# EAGLE design TwoDigitThermometer (EAGLE 7.6.0)

## Sheet 1 of 2
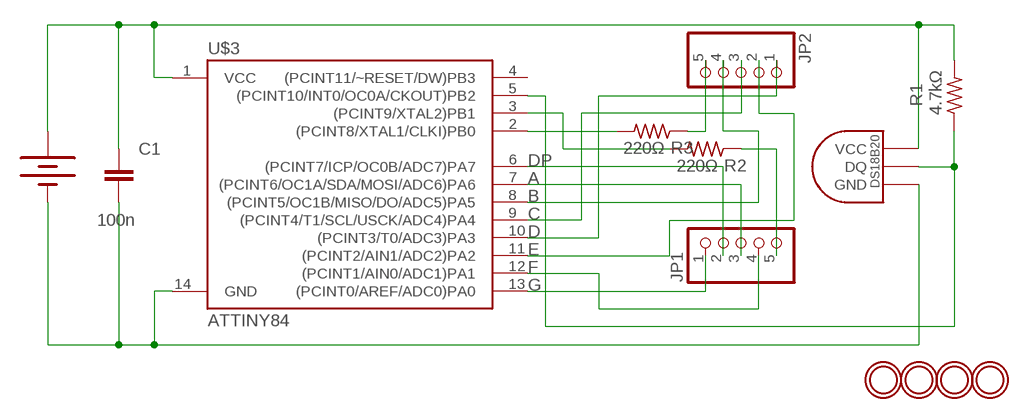
[diagram p0: schematic, sheet 1]

### Parts
BAT1  20mm coincell  BATTERY20SMD  [BATTCON_20MM]
C1  100n  CAP0603-CAP  [0603-CAP]
JP1  HEADER-1X5EDGESMT  [1X05_EDGESMT]
JP2  HEADER-1X5EDGESMT  [1X05_EDGESMT]
R1  4.7kΩ  R-US_R0805  [R0805]
R2  220Ω  R-US_R0805  [R0805]
R3  220Ω  R-US_R0805  [R0805]
U$1  MOUNTINGHOLE2.5  [MOUNTINGHOLE_2.5_PLATED]
U$2  DS1820  [µSOP8]
U$3  ATTINY84  [SO14]
U$4  MOUNTINGHOLE2.5  [MOUNTINGHOLE_2.5_PLATED]
U$5  MOUNTINGHOLE2.5  [MOUNTINGHOLE_2.5_PLATED]
U$9  MOUNTINGHOLE2.5  [MOUNTINGHOLE_2.5_PLATED]

### Nets
A: JP1.3 U$3.7((PCINT6/OC1A/SDA/MOSI/ADC6)PA6)
B: JP2.4 U$3.8((PCINT5/OC1B/MISO/DO/ADC5)PA5)
C: JP2.3 U$3.9((PCINT4/T1/SCL/USCK/ADC4)PA4)
D: JP2.1 U$3.10((PCINT3/T0/ADC3)PA3)
DP: JP1.2 U$3.6((PCINT7/ICP/OC0B/ADC7)PA7)
E: JP2.2 U$3.11((PCINT2/AIN1/ADC2)PA2)
F: JP1.4 U$3.12((PCINT1/AIN0/ADC1)PA1)
G: JP1.1 U$3.13((PCINT0/AREF/ADC0)PA0)
N$1: BAT1.1(+) C1.1 R1.2 U$2.8(VCC) U$3.1(VCC)
N$2: R1.1 U$2.1(DQ) U$3.5((PCINT10/INT0/OC0A/CKOUT)PB2)
N$3: R3.2 U$3.2((PCINT8/XTAL1/CLKI)PB0)
N$4: R2.2 U$3.3((PCINT9/XTAL2)PB1)
N$6: BAT1.2(-) C1.2 U$2.4(GND) U$3.14(GND)
N$10: JP1.5 R2.1
N$11: JP2.5 R3.1
Unconnected: U$3.4((PCINT11/~RESET/DW)PB3)

## Sheet 2 of 2

## Library data of the parts
BAT1 = SparkFun-Electromechanical:BATTERY: Battery Holders Various common sizes : AA, AAA, 18650 (PRT-12895), 20mm coin cell and 12mm coin cell. 20MM_4LEGS, BATT-10373
C1 = SparkFun-Capacitors:CAP: Capacitor Standard 0603 ceramic capacitor, and 0.1" leaded capacitor.
JP1 JP2 = microbuilder:HEADER-1X5: PIN HEADER
R1-R3 = adafruit:R-US_: RESISTOR, American symbol
U$1 U$4 U$5 U$9 = microbuilder:MOUNTINGHOLE: Mounting Hole For #2 screws (0.086"/2.18mm width, 0.094"/2.4mm hole) use 2.5mm; BOM: EXCLUDE
U$2 = Ava:DS1820: DS18B20 Programmable Resolution 1-Wire Digital Thermometer Description The DS18B20 digital thermometer provides 9-bit to 12-bit Celsius temperature measurements and has an alarm function with nonvolatile user-programmable upper and lower trigger points. The DS18B20 communicates over a 1-Wire® bus that by definition requires only one data line (and ground) for communication with a central microprocessor. It has an operating temperature range of -55°C to +125°C and is accurate to ±0.5°C over the range of -10°C to +85°C. In addition, the DS18B20 can derive power directly from the data line ("parasite power"), eliminating the need for an external power supply. Each DS18B20 has a unique 64-bit serial code, which allows multiple DS18B20s to function on the same 1-Wire bus. Thus, it is simple to use one microprocessor to control many DS18B20s distributed over a large area. Applications that can benefit from this feature include HVAC environmental controls, temperature monitoring systems inside buildings, equipment, or machinery, and process monitoring and control systems.
U$3 = SparkFun-DigitalIC:ATTINY84: Atmel 14-pin 2/4/8kB flash uC; PROD_ID: IC-11285

## Board
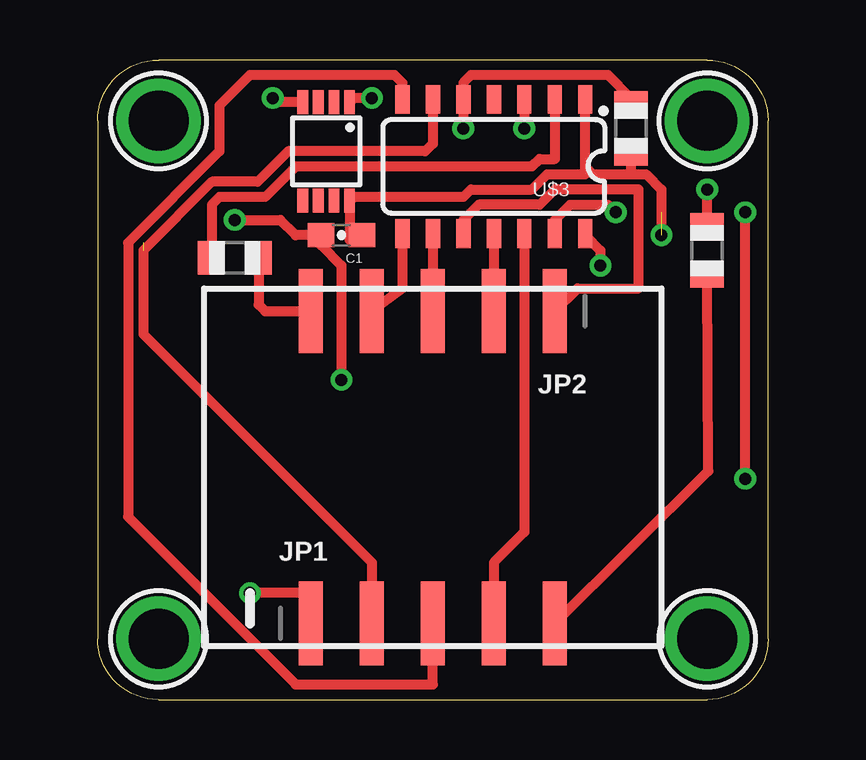
[diagram p1: board, top side]
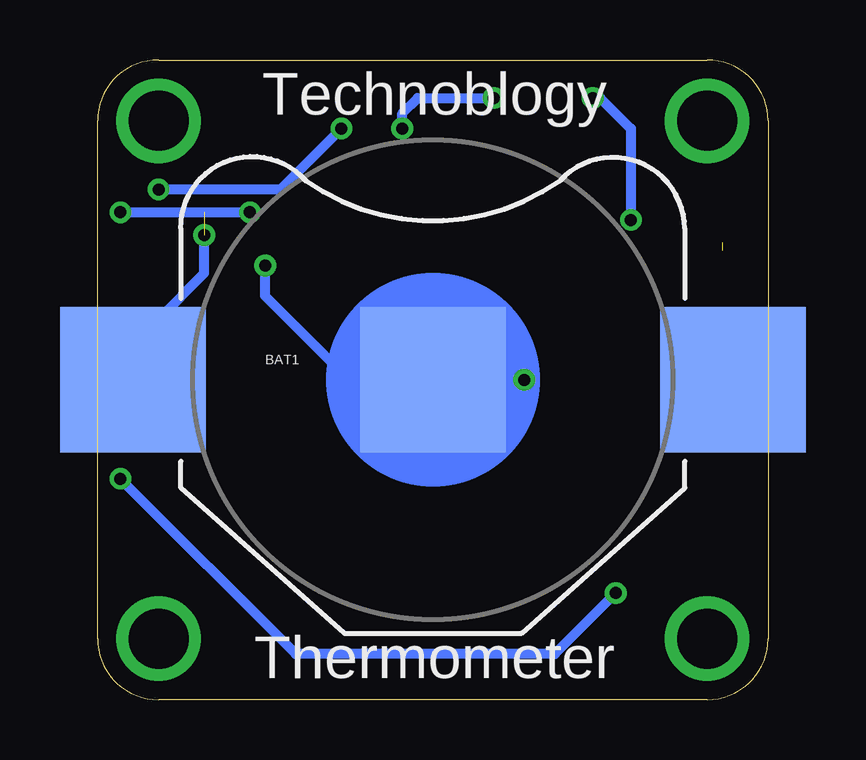
[diagram p2: board, bottom side, seen from below]

Size 27.94 x 26.67 mm. Coordinates in mm from the lower left corner, seen from the top.
Outline: 2.54,0 25.4,0 arc90 27.94,2.54 27.94,24.13 arc90 25.4,26.67 2.54,26.67 arc90 0,24.13 0,2.54 arc90 2.54,0
Copper layers (1*16): Top 0.035mm / dielectric 1.5mm / Bottom 0.035mm
Design rules "default *": minimum track width 10mil, minimum drill 24mil, track to track 8mil, track to pad 8mil, pad to pad 8mil, via to via 8mil, smd to smd 8mil, copper to edge 40mil, drill to drill 8mil, minimum pad ring 10mil, minimum via ring 8mil, stop-mask expansion 4mil, vias tented up to drill 20mil, thermal gap 10mil

### Footprints (pad centres in the part's own frame; a part is rotated, then mirrored left to right if it is on the bottom)
BATTCON_20MM = smd 6.07 x 6.07: 1 -12.5,0; 2 0,0; 3 12.5,0
0603-CAP = smd 1.1 x 1: 1 -0.85,0; 2 0.85,0
1X05_EDGESMT = smd 1 x 3.5: 1 -5.08,0; 2 -2.54,0; 3 0,0; 4 2.54,0; 5 5.08,0
R0805 = smd 1.1 x 1.4: 1 -1,0; 2 1,0
MOUNTINGHOLE_2.5_PLATED = drill 2.5 pad 3.2: P$1 0,0
µSOP8 = smd 0.45 x 1: 1 -0.975,-2.05; 2 -0.325,-2.05; 3 0.325,-2.05; 4 0.975,-2.05; 5 0.975,2.05; 6 0.325,2.05; 7 -0.325,2.05; 8 -0.975,2.05
SO14 = smd 0.6 x 1.2: 1 -3.81,-2.8; 2 -2.54,-2.8; 3 -1.27,-2.8; 4 0,-2.8; 5 1.27,-2.8; 6 2.54,-2.8; 7 3.81,-2.8; 8 3.81,2.8; 9 2.54,2.8; 10 1.27,2.8; 11 0,2.8; 12 -1.27,2.8; 13 -2.54,2.8; 14 -3.81,2.8

### Placement (x,y rotation side)
BAT1  13.97,13.33 0 bottom
C1  10.16,19.37 180 top
JP1  13.97,3.17 0 top
JP2  13.97,16.19 180 top
R1  22.22,23.81 270 top
R2  25.4,18.73 90 top
R3  5.71,18.42 180 top
U$1  2.54,2.54 0 top
U$2  9.53,22.86 180 top
U$3  16.51,22.23 180 top
U$4  25.4,2.54 0 top
U$5  2.54,24.13 0 top
U$9  25.4,24.13 0 top

### Tracks (layer width: path | path; a pad name or v marks a point on that pad's centre or on a via)
A
  Top 0.406: 13.97,4.45 JP1.3 13.97,0.64 8.26,0.64 1.27,7.62 1.27,19.05 5.08,22.86 5.08,24.77 6.35,26.04 12.38,26.04 12.7,25.72 U$3.7
B
  Top 0.406: U$3.8 12.7,17.14 JP2.4
C
  Top 0.406: U$3.9 JP2.3
D
  Top 0.406: JP2.1 20,17.14 22.54,17.14 22.54,21.27 19.05,21.27 18.41,20.64 15.88,20.64 15.24,20 U$3.10
DP  (1 unrouted)
  Top 0.406: U$3.6 13.97,23.18 13.65,22.86 7.94,22.86 6.67,21.59 4.76,21.59 1.91,18.73 1.91,15.24 11.43,5.71 JP1.2
E
  Top 0.406: U$3.11 JP2.2
F
  Top 0.406: JP1.4 16.51,5.71 17.78,6.99 U$3.12
G  (via drill 0.5)
  Top 0.406: JP1.1 8.89,4.45 v6.35,4.45 | v26.99,9.21 v26.99,20.32 | U$3.13 19.05,20 19.68,20.64 21.27,20.64 v21.59,20.32
  Bottom 0.406: v6.35,4.45 8.89,1.91 19.68,1.91 v26.99,9.21 | v26.99,20.32 v21.59,20.32
N$1  (via drill 0.5)  (1 unrouted)
  Top 0.406: 20.32,22.23 20.32,21.91 18.73,21.91 18.1,21.27 15.56,21.27 15.24,20.96 10.67,20.96 U$2.8 10.5,19.18 C1.1 | 20.32,22.23 U$3.1 | 20.32,22.23 20.64,21.91 22.22,21.91 | 22.22,21.91 22.86,21.91 23.5,21.27 v23.5,19.37 | R1.2 22.22,21.91
  Bottom 0.406: BAT1.1 26.67,13.33 26.67,15.88 25.4,15.88 23.5,17.78 v23.5,19.37
N$2  (via drill 0.5)
  Top 0.406: 10.48,25.21 U$2.1 10.64,25.08 v11.43,25.08 | v15.24,23.81 U$3.5 15.24,25.72 15.56,26.04 21.27,26.04 22.22,25.08 R1.1
  Bottom 0.406: v15.24,23.81 15.24,24.45 14.61,25.08 v11.43,25.08
N$3
  Top 0.406: U$3.2 19.05,22.54 18.41,22.54 18.1,22.23 8.26,22.23 6.98,20.96 5.08,20.96 4.76,20.64 4.76,18.46 R3.2
N$4  (via drill 0.5)
  Top 0.406: U$3.3 v17.78,23.81 | R2.2 v25.4,21.27
  Bottom 0.406: v17.78,23.81 20.32,21.27 v25.4,21.27
N$6  (via drill 0.5)
  Top 0.406: v10.16,13.33 10.16,18.1 9.31,18.95 C1.2 8.26,19.37 7.62,20 v5.71,20 | U$3.14 20.32,19.37 20.95,18.73 v20.95,18.1 | U$2.4 7.47,24.91 v7.3,25.08
  Bottom 0.406: v10.16,13.33 BAT1.2 17.46,13.33 20.95,16.83 v20.95,18.1 | v7.3,25.08 6.98,25.08 5.71,23.81 v5.71,20
N$10
  Top 0.406: JP1.5 25.45,9.53 R2.1
N$11
  Top 0.406: 6.71,18.69 R3.1 6.71,16.46 6.98,16.19 JP2.5
(copper drawn outside any net)
  shapes: Bottom circle x1

### Text on the board
bPlace: Technoblogy | Thermometer